# EAGLE schematic RPiHeatingArduinoOilSensor433 (EAGLE 7.5.0)
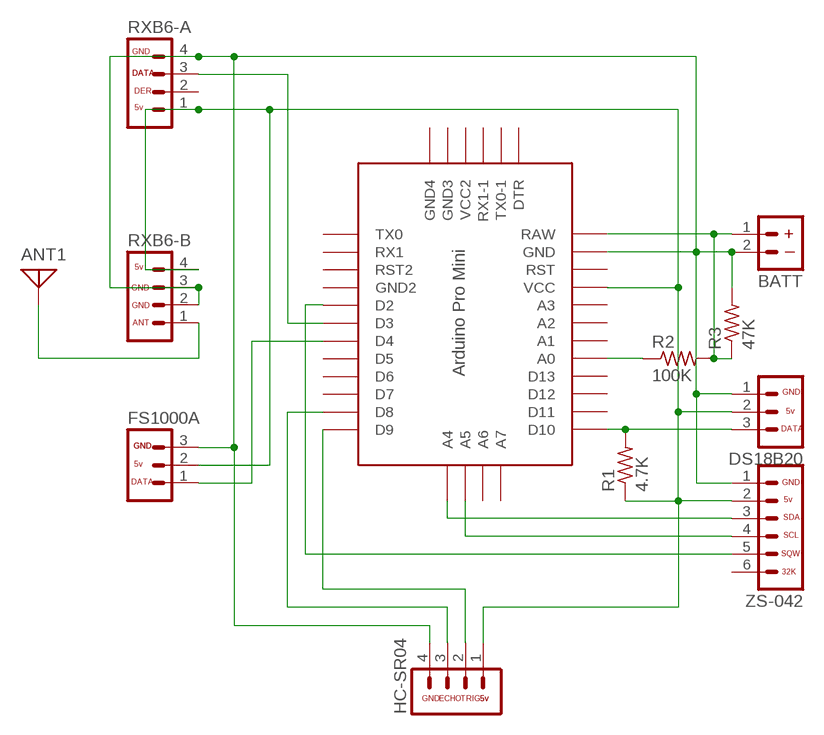
[diagram p0: schematic, sheet 1]

## Parts
ANT1  ANTENNA  [PAD-01]
BATT  M02PTH  [1X02]
DS18B20  M03JST-PTH-VERT  [JST-3-PTH-VERT]
FS1000A  M03LONGPADS  [1X03_LONGPADS]
HC-SR04  M04LONGPADS  [1X04_LONGPADS]
R1  4.7K  R-US_0204/7  [0204/7]
R2  100K  R-US_0207/10  [0207/10]
R3  47K  R-US_0207/10  [0207/10]
RXB6-A  M04LONGPADS  [1X04_LONGPADS]
RXB6-B  M04LONGPADS  [1X04_LONGPADS]
U$1  PRO-MINI  [PRO-MINI]
ZS-042  M06LONGPADS  [1X06_LONGPADS]

## Nets
5V: DS18B20.2 FS1000A.2 HC-SR04.1 R1.1 RXB6-A.1 RXB6-B.4 U$1.VCC ZS-042.2
GND: BATT.2 DS18B20.1 FS1000A.3 HC-SR04.4 R3.2 RXB6-A.4 RXB6-B.2 RXB6-B.3 U$1.GND ZS-042.1
N$1: RXB6-A.3 U$1.D3
N$2: FS1000A.1 U$1.D4
N$3: HC-SR04.3 U$1.D8
N$4: ANT1.1 RXB6-B.1
N$5: BATT.1 R2.2 R3.1 U$1.RAW
N$6: DS18B20.3 R1.2 U$1.D10
N$8: HC-SR04.2 U$1.D9
N$9: U$1.A4 ZS-042.3
N$10: U$1.A5 ZS-042.4
N$11: U$1.D2 ZS-042.5
N$12: R2.1 U$1.A0
Unconnected: RXB6-A.2 U$1.A1 U$1.A2 U$1.A3 U$1.A6 U$1.A7 U$1.D5 U$1.D6 U$1.D7 U$1.D11 U$1.D12 U$1.D13 U$1.DTR U$1.GND1(GND2) U$1.GND2(GND4) U$1.GND3 U$1.RST U$1.RST1(RST2) U$1.RX1 U$1.RX1-1 U$1.TX0 U$1.TX0-1 U$1.VCC1(VCC2) ZS-042.6

## Notes on the sheet
- GND
- DATA | DATA
- DER
- 5v
- +
- _
- 5v
- GND
- GND
- ANT
- GND
- 5v
- DATA
- GND | GND
- 5v
- DATA | GND
- 5v
- SDA
- SCL
- SQW
- 32K
- GND | ECHO | TRIG | 5v | 5v

## Library data of the parts
ANT1 = discrete:ANTENNA: Antenna
BATT = SparkFun-Connectors:M02: Standard 2-pin 0.1" header. Use with - straight break away headers ( PRT-00116) - right angle break away headers (PRT-00553) - swiss pins (PRT-00743) - machine pins (PRT-00117) - female headers (PRT-00115) Molex polarized connector foot print use with: PRT-08233 with associated crimp pins and housings. 2.54_SCREWTERM for use with PRT-10571. 3.5mm Screw Terminal footprints for PRT-08084 5mm Screw Terminal footprints for use with PRT-08432
DS18B20 FS1000A = SparkFun-Connectors:M03: Header 3 Standard 3-pin 0.1" header. Use with straight break away headers (SKU : PRT-00116), right angle break away headers (PRT-00553), swiss pins (PRT-00743), machine pins (PRT-00117), and female headers (PRT-00115). Molex polarized connector foot print use with SKU : PRT-08232 with associated crimp pins and housings.
HC-SR04 RXB6-A RXB6-B = SparkFun-Connectors:M04: Header 4 Standard 4-pin 0.1" header. Use with straight break away headers (SKU : PRT-00116), right angle break away headers (PRT-00553), swiss pins (PRT-00743), machine pins (PRT-00117), and female headers (PRT-00115). Molex polarized connector foot print use with SKU : PRT-08231 with associated crimp pins and housings. 1MM SMD Version SKU: PRT-10208
R1-R3 = adafruit:R-US_: RESISTOR, American symbol
U$1 = Arduino-clone:PRO-MINI: Arduion Pro Mini Clone V1.0 www.betemcu.cu
ZS-042 = SparkFun-Connectors:M06: Header 6 Standard 6-pin 0.1" header. Use with straight break away headers (SKU : PRT-00116), right angle break away headers (PRT-00553), swiss pins (PRT-00743), machine pins (PRT-00117), and female headers (PRT-00115). Molex polarized connector foot print use with SKU : PRT-08094 with associated crimp pins and housings. NOTES ON THE VARIANTS LOCK and LOCK_LONGPADS... This footprint was designed to help hold the alignment of a through-hole component (i.e. 6-pin header) while soldering it into place. You may notice that each hole has been shifted either up or down by 0.005 of an inch from it's more standard position (which is a perfectly straight line). This slight alteration caused the pins (the squares in the middle) to touch the edges of the holes. Because they are alternating, it causes a "brace" to hold the component in place. 0.005 has proven to be the perfect amount of "off-center" position when using our standard breakaway headers. Although looks a little odd when you look at the bare footprint, once you have a header in there, the alteration is very hard to notice. Also,if you push a header all the way into place, it is covered up entirely on the bottom side. This idea of altering the position of holes to aid alignment will be further integrated into the Sparkfun Library for other footprints. It can help hold any component with 3 or more connection pins.